# EAGLE board csa_drvio_v1.0b (EAGLE 4.15)
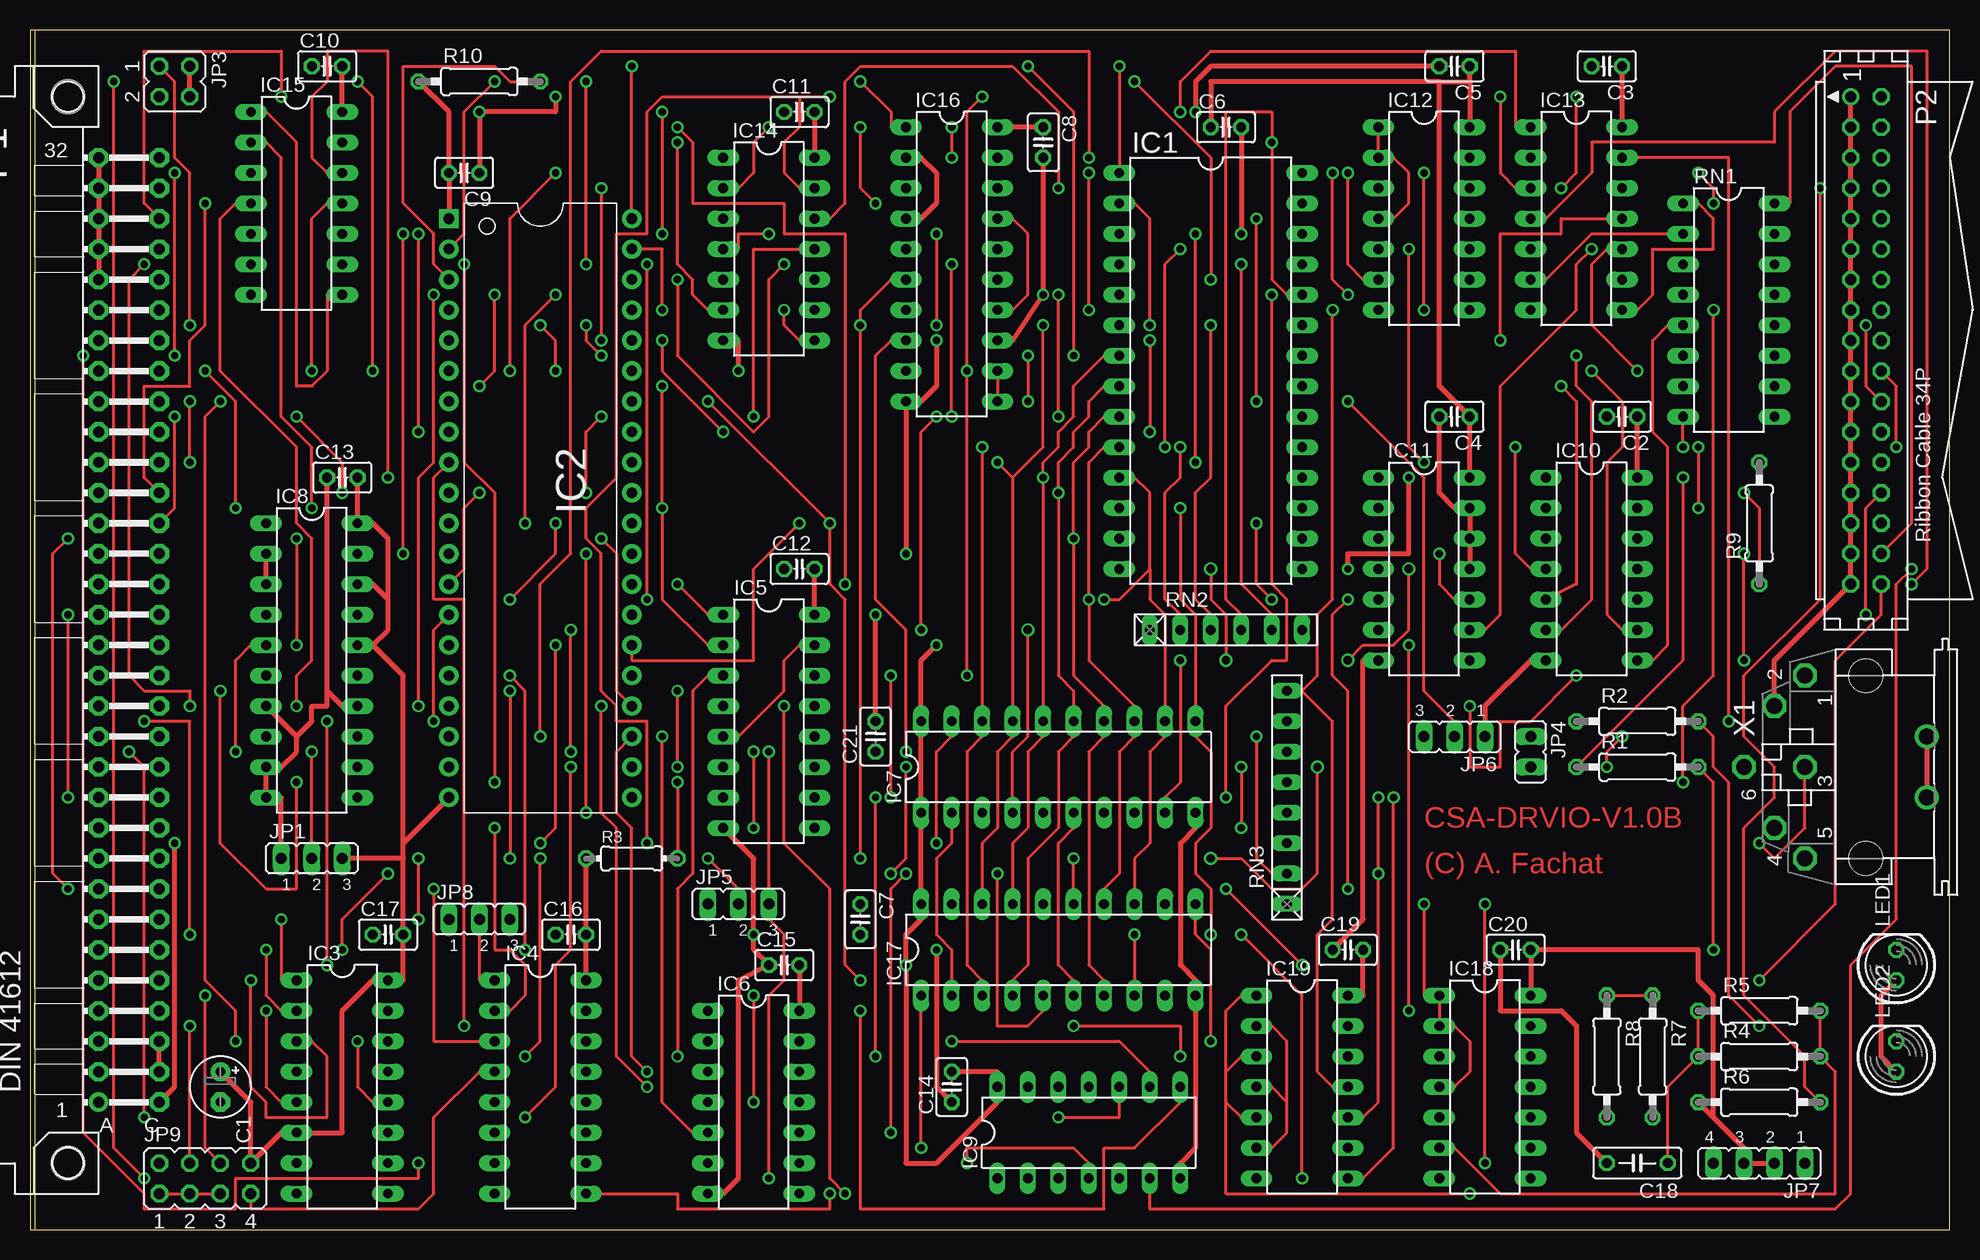
[diagram p1: board, top side]
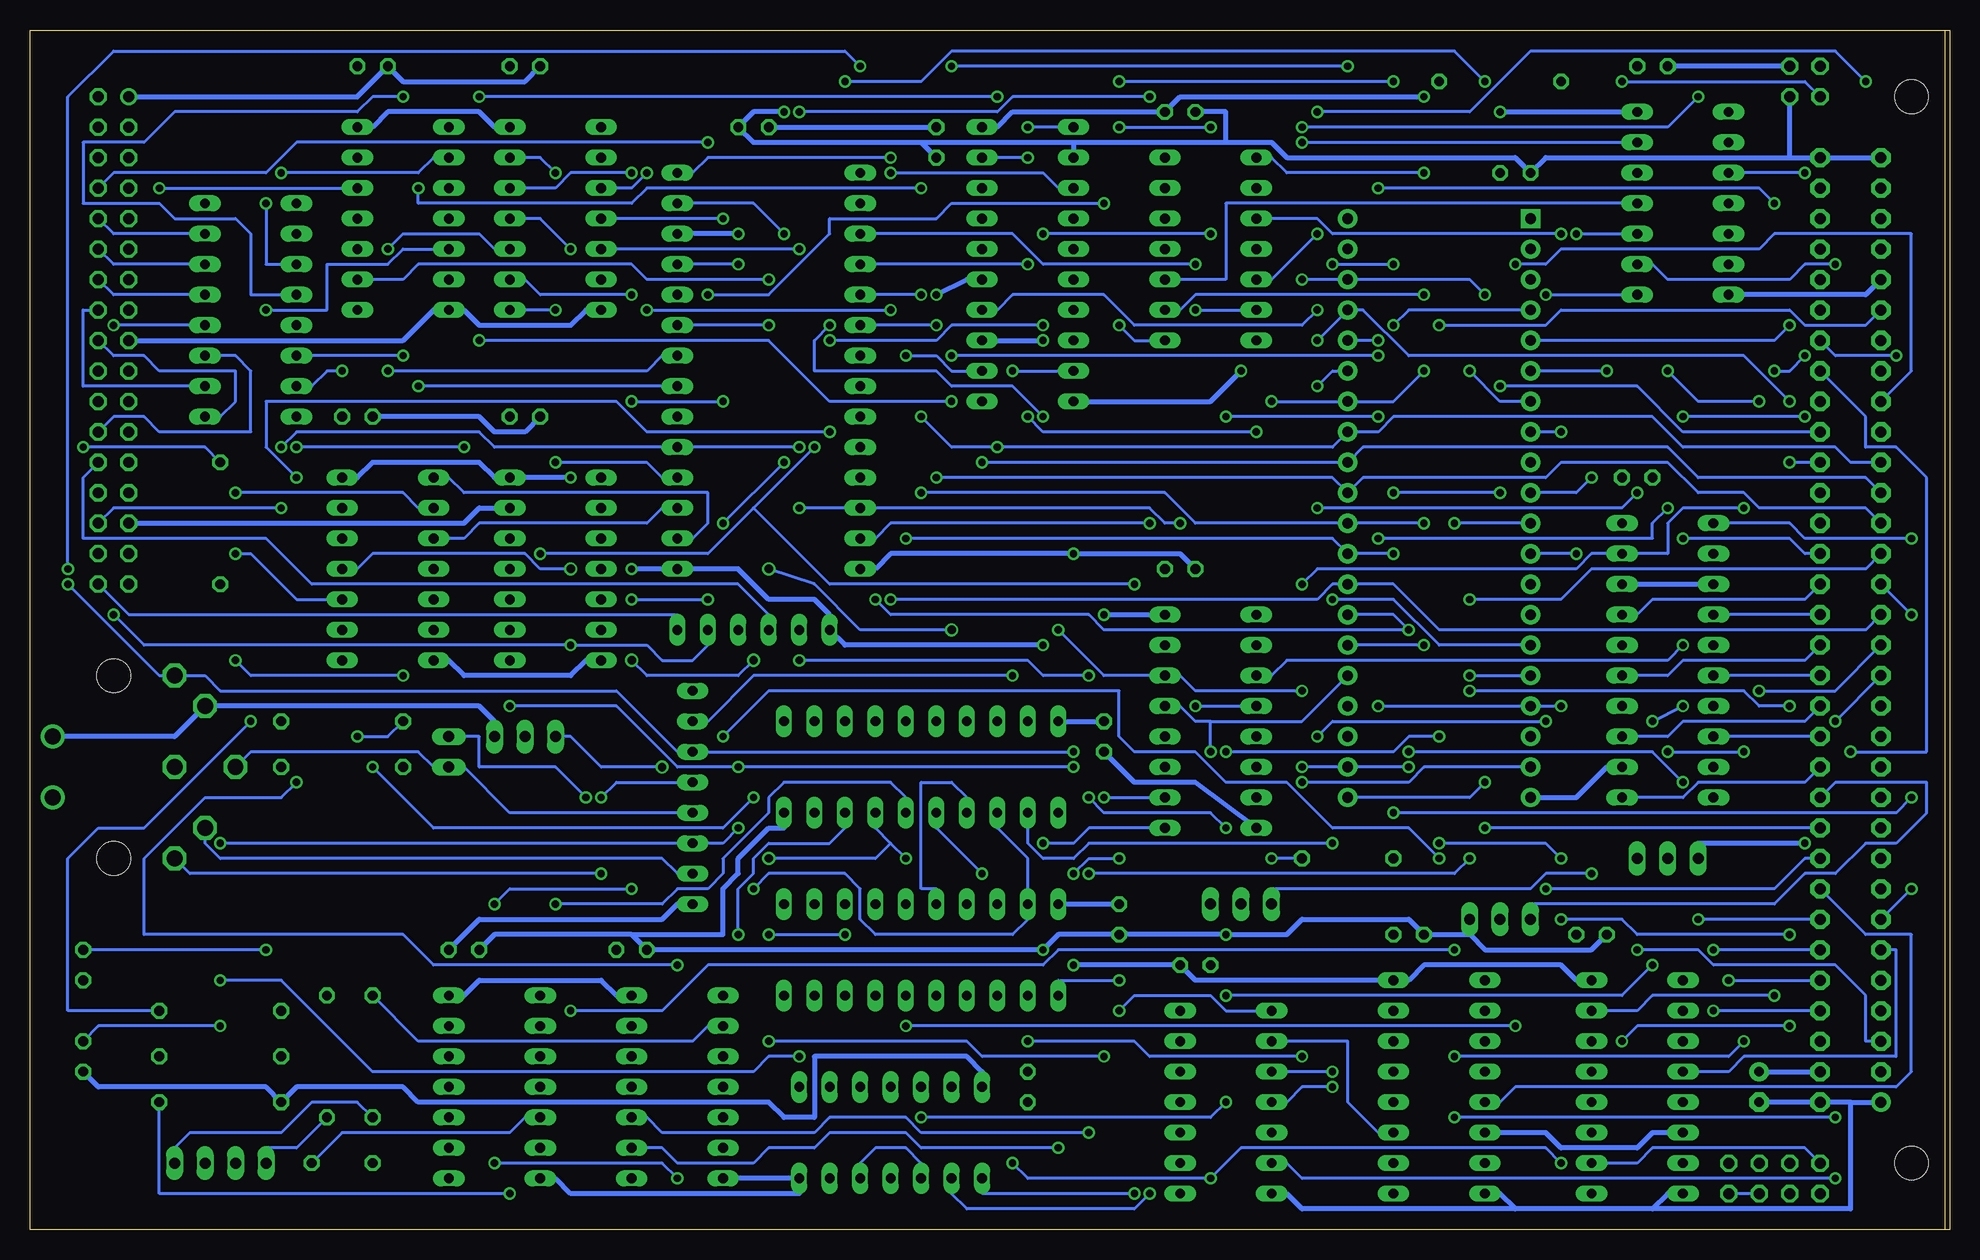
[diagram p2: board, bottom side, seen from below]

Size 160 x 100.03 mm. Coordinates in mm from the lower left corner, seen from the top.
Outline: 0,0.01 160,0.01 160,100.01 0,100.01 0,0.01
Copper layers (1*16): Top 0.035mm / dielectric 1.5mm / Bottom 0.035mm
Design rules "default": minimum track width 10mil, minimum drill 24mil, track to track 8mil, track to pad 8mil, pad to pad 8mil, via to via 8mil, smd to smd 8mil, copper to edge 40mil, drill to drill 8mil, minimum pad ring 10mil, minimum via ring 8mil, stop-mask expansion 4mil, vias tented up to drill 0mil, thermal gap 10mil

## Footprints (pad centres in the part's own frame; a part is rotated, then mirrored left to right if it is on the bottom)
E2,5-5 = drill 0.813 pad 1.6 round: + -1.27,0 | drill 0.813 pad 1.6 octagon: - 1.27,0
C025-025X050 = drill 0.813 octagon: 1 -1.27,0; 2 1.27,0
C050-025X075 = drill 0.813 octagon: 1 -2.54,0; 2 2.54,0
DIL28 = drill 0.813 long: 1 -13.97,-7.62; 2 -11.43,-7.62; 3 -8.89,-7.62; 4 -6.35,-7.62; 5 -3.81,-7.62; 6 -1.27,-7.62; 7 1.27,-7.62; 8 3.81,-7.62; 9 6.35,-7.62; 10 8.89,-7.62; 11 11.43,-7.62; 12 13.97,-7.62; 13 16.51,-7.62; 14 19.05,-7.62; 15 19.05,7.62; 16 16.51,7.62; 17 13.97,7.62; 18 11.43,7.62; 19 8.89,7.62; 20 6.35,7.62; 21 3.81,7.62; 22 1.27,7.62; 23 -1.27,7.62; 24 -3.81,7.62; 25 -6.35,7.62; 26 -8.89,7.62; 27 -11.43,7.62; 28 -13.97,7.62
DIP40 = drill 0.889 pad 1.6 square: 1 -24.13,-7.62 | drill 0.889 pad 1.6 round: 2 -21.59,-7.62; 3 -19.05,-7.62; 4 -16.51,-7.62; 5 -13.97,-7.62; 6 -11.43,-7.62; 7 -8.89,-7.62; 8 -6.35,-7.62; 9 -3.81,-7.62; 10 -1.27,-7.62; 11 1.27,-7.62; 12 3.81,-7.62; 13 6.35,-7.62; 14 8.89,-7.62; 15 11.43,-7.62; 16 13.97,-7.62; 17 16.51,-7.62; 18 19.05,-7.62; 19 21.59,-7.62; 20 24.13,-7.62; 21 24.13,7.62; 22 21.59,7.62; 23 19.05,7.62; 24 16.51,7.62; 25 13.97,7.62; 26 11.43,7.62; 27 8.89,7.62; 28 6.35,7.62; 29 3.81,7.62; 30 1.27,7.62; 31 -1.27,7.62; 32 -3.81,7.62; 33 -6.35,7.62; 34 -8.89,7.62; 35 -11.43,7.62; 36 -13.97,7.62; 37 -16.51,7.62; 38 -19.05,7.62; 39 -21.59,7.62; 40 -24.13,7.62
DIL16 = drill 0.813 long: 1 -8.89,-3.81; 2 -6.35,-3.81; 3 -3.81,-3.81; 4 -1.27,-3.81; 5 1.27,-3.81; 6 3.81,-3.81; 7 6.35,-3.81; 8 8.89,-3.81; 9 8.89,3.81; 10 6.35,3.81; 11 3.81,3.81; 12 1.27,3.81; 13 -1.27,3.81; 14 -3.81,3.81; 15 -6.35,3.81; 16 -8.89,3.81
DIL14 = drill 0.813 long: 1 -7.62,-3.81; 2 -5.08,-3.81; 3 -2.54,-3.81; 4 0,-3.81; 5 2.54,-3.81; 6 5.08,-3.81; 7 7.62,-3.81; 8 7.62,3.81; 9 5.08,3.81; 10 2.54,3.81; 11 0,3.81; 12 -2.54,3.81; 13 -5.08,3.81; 14 -7.62,3.81
DIL20 = drill 0.813 long: 1 -11.43,-3.81; 2 -8.89,-3.81; 3 -6.35,-3.81; 4 -3.81,-3.81; 5 -1.27,-3.81; 6 1.27,-3.81; 7 3.81,-3.81; 8 6.35,-3.81; 9 8.89,-3.81; 10 11.43,-3.81; 11 11.43,3.81; 12 8.89,3.81; 13 6.35,3.81; 14 3.81,3.81; 15 1.27,3.81; 16 -1.27,3.81; 17 -3.81,3.81; 18 -6.35,3.81; 19 -8.89,3.81; 20 -11.43,3.81
DIL20' = drill 0.813 long: 1 -10.16,-3.81; 2 -7.62,-3.81; 3 -5.08,-3.81; 4 -2.54,-3.81; 5 0,-3.81; 6 2.54,-3.81; 7 5.08,-3.81; 8 7.62,-3.81; 9 10.16,-3.81; 10 12.7,-3.81; 11 12.7,3.81; 12 10.16,3.81; 13 7.62,3.81; 14 5.08,3.81; 15 2.54,3.81; 16 0,3.81; 17 -2.54,3.81; 18 -5.08,3.81; 19 -7.62,3.81; 20 -10.16,3.81
JP2 = drill 0.914 long: 1 -2.54,0; 2 0,0; 3 2.54,0
JP2Q = drill 0.914 octagon: 1 -1.27,-1.27; 2 -1.27,1.27; 3 1.27,-1.27; 4 1.27,1.27
JP1 = drill 0.914 long: 1 0,-1.27; 2 0,1.27
JP4 = drill 0.914 long: 1 -3.81,0; 2 -1.27,0; 3 1.27,0; 4 3.81,0
JP4Q = drill 0.914 octagon: 1 -3.81,-1.27; 2 -3.81,1.27; 3 -1.27,-1.27; 4 -1.27,1.27; 5 1.27,-1.27; 6 1.27,1.27; 7 3.81,-1.27; 8 3.81,1.27
LED5MM = drill 0.813 octagon: A -1.27,0; K 1.27,0
CSABUS = drill 0.914 pad 1.6 round: A1 7.62,36.83 | drill 0.914 pad 1.6 octagon: A2 7.62,34.29; A3 7.62,31.75; A4 7.62,29.21; A5 7.62,26.67; A6 7.62,24.13; A7 7.62,21.59; A8 7.62,19.05; A9 7.62,16.51; A10 7.62,13.97; A11 7.62,11.43; A12 7.62,8.89; A13 7.62,6.35; A14 7.62,3.81; A15 7.62,1.27; A16 7.62,-1.27; A17 7.62,-3.81; A18 7.62,-6.35; A19 7.62,-8.89; A20 7.62,-11.43; A21 7.62,-13.97; A22 7.62,-16.51; A23 7.62,-19.05; A24 7.62,-21.59; A25 7.62,-24.13; A26 7.62,-26.67; A27 7.62,-29.21; A28 7.62,-31.75; A29 7.62,-34.29; A30 7.62,-36.83; A31 7.62,-39.37; A32 7.62,-41.91; C1 2.54,36.83; C2 2.54,34.29; C3 2.54,31.75; C4 2.54,29.21; C5 2.54,26.67; C6 2.54,24.13; C7 2.54,21.59; C8 2.54,19.05; C9 2.54,16.51; C10 2.54,13.97; C11 2.54,11.43; C12 2.54,8.89; C13 2.54,6.35; C14 2.54,3.81; C15 2.54,1.27; C16 2.54,-1.27; C17 2.54,-3.81; C18 2.54,-6.35; C19 2.54,-8.89; C20 2.54,-11.43; C21 2.54,-13.97; C22 2.54,-16.51; C23 2.54,-19.05; C24 2.54,-21.59; C25 2.54,-24.13; C26 2.54,-26.67; C27 2.54,-29.21; C28 2.54,-31.75; C29 2.54,-34.29; C30 2.54,-36.83; C31 2.54,-39.37; C32 2.54,-41.91 | hole 2.794: 10.16,41.91; 10.16,-46.99
CON34 = drill 0.914 round: 1 -19.05,-1.27 | drill 0.914 octagon: 2 -19.05,1.27; 3 -16.51,-1.27; 4 -16.51,1.27; 5 -13.97,-1.27; 6 -13.97,1.27; 7 -11.43,-1.27; 8 -11.43,1.27; 9 -8.89,-1.27; 10 -8.89,1.27; 11 -6.35,-1.27; 12 -6.35,1.27; 13 -3.81,-1.27; 14 -3.81,1.27; 15 -1.27,-1.27; 16 -1.27,1.27; 17 1.27,-1.27; 18 1.27,1.27; 19 3.81,-1.27; 20 3.81,1.27; 21 6.35,-1.27; 22 6.35,1.27; 23 8.89,-1.27; 24 8.89,1.27; 25 11.43,-1.27; 26 11.43,1.27; 27 13.97,-1.27; 28 13.97,1.27; 29 16.51,-1.27; 30 16.51,1.27; 31 19.05,-1.27; 32 19.05,1.27; 33 21.59,-1.27; 34 21.59,1.27
0207/10 = drill 0.813 octagon: 1 -5.08,0; 2 5.08,0
0204/7 = drill 0.813 octagon: 1 -3.81,0; 2 3.81,0
RN-6 = drill 0.813 long: 1 -6.35,0; 2 -3.81,0; 3 -1.27,0; 4 1.27,0; 5 3.81,0; 6 6.35,0
RN-8 = drill 0.813 long: 1 -8.89,0; 2 -6.35,0; 3 -3.81,0; 4 -1.27,0; 5 1.27,0; 6 3.81,0; 7 6.35,0; 8 8.89,0
MAB6H = drill 1.321 octagon: 1 7.62,5.08; 2 5.08,7.62; 3 0,5.08; 4 -5.08,7.62; 5 -7.62,5.08; 6 0,10.16 | drill 1.321 round: PE -2.54,-5.08; PE@ 2.54,-5.08 | hole 2.794: 7.62,0; -7.62,0

## Placement (x,y rotation side)
C1  47u  [E2,5-5]  15.87,11.91 270 top
C2  [C025-025X050]  132.71,67.79 180 top
C3  [C025-025X050]  131.44,97 180 top
C4  [C025-025X050]  118.74,67.79 180 top
C5  [C025-025X050]  118.74,97 180 top
C6  [C025-025X050]  99.69,91.92 0 top
C7  [C025-025X050]  69.21,25.88 270 top
C8  [C025-025X050]  84.45,90.65 270 top
C9  [C025-025X050]  36.19,88.11 180 top
C10  [C025-025X050]  24.76,97 0 top
C11  [C025-025X050]  64.13,93.19 0 top
C12  [C025-025X050]  64.13,55.09 0 top
C13  [C025-025X050]  26.03,62.71 0 top
C14  [C025-025X050]  76.83,11.91 90 top
C15  [C025-025X050]  62.86,22.07 0 top
C16  [C025-025X050]  45.08,24.61 0 top
C17  [C025-025X050]  29.84,24.61 0 top
C18  100n  [C050-025X075]  133.98,5.56 180 top
C19  [C025-025X050]  109.85,23.34 0 top
C20  [C025-025X050]  123.82,23.34 0 top
C21  [C025-025X050]  70.48,41.12 90 top
IC1  WD1770  [DIL28]  98.42,74.14 270 top
IC2  CIASMALLPADS  [DIP40]  42.54,60.17 270 top
IC3  74HCT138N  [DIL16]  26.03,11.91 270 top
IC4  74HCT138N  [DIL16]  42.54,11.91 270 top
IC5  74HCT139N  [DIL16]  61.59,42.39 270 top
IC6  74HCT08N  [DIL14]  60.32,10.64 270 top
IC7  74HCT245N  [DIL20]  85.72,38.58 0 top
IC8  74LS688BUSOPT  [DIL20']  23.49,48.74 270 top
IC9  74HCT00N  [DIL14]  88.26,8.1 0 top
IC10  74LS06N  [DIL14]  130.17,55.09 270 top
IC11  74LS293N  [DIL14]  116.2,55.09 270 top
IC12  74HCT00N  [DIL14]  116.2,84.3 270 top
IC13  74LS07N  [DIL14]  128.9,84.3 270 top
IC14  74LS06N  [DIL14]  61.59,81.76 270 top
IC15  74HC14N  [DIL14]  22.22,85.57 270 top
IC16  74HCT241N  [DIL20]  76.83,80.49 270 top
IC17  74LS273BUSOPT  [DIL20']  84.45,23.34 0 top
IC18  74LS13N  [DIL14]  121.28,11.91 270 top
IC19  74LS07N  [DIL14]  106.04,11.91 270 top
JP1  [JP2]  23.49,30.96 0 top
JP3  [JP2Q]  12.06,95.73 270 top
JP4  [JP1]  125.09,39.85 180 top
JP5  [JP2]  59.05,27.15 0 top
JP6  [JP2]  118.74,41.12 180 top
JP7  [JP4]  144.14,5.56 180 top
JP8  [JP2]  37.46,25.88 0 top
JP9  [JP4Q]  14.6,4.29 0 top
LED1  [LED5MM]  155.57,22.07 90 top
LED2  [LED5MM]  155.57,14.45 90 top
P1  CSABUS  [CSABUS]  13.33,47.47 180 top
P2  SHUGART  [CON34]  153.03,75.41 270 top
R1  150  [0207/10]  133.98,38.58 0 top
R2  620  [0207/10]  133.98,42.39 0 top
R3  10k  [0204/7]  50.16,30.96 0 top
R4  220  [0207/10]  144.14,14.45 0 top
R5  1k2  [0207/10]  144.14,18.26 0 top
R6  10k  [0207/10]  144.14,10.64 0 top
R7  68  [0207/10]  135.25,14.45 270 top
R8  68  [0207/10]  131.44,14.45 270 top
R9  47  [0207/10]  144.14,58.9 90 top
R10  2k2  [0207/10]  37.46,95.73 0 top
RN1  47  [DIL16]  141.6,76.68 270 top
RN2  10k  [RN-6]  99.69,50.01 0 top
RN3  10k  [RN-8]  104.77,36.04 90 top
X1  MAB6H  [MAB6H]  153.03,38.58 90 top

## Tracks (layer width: path | path; a pad name or v marks a point on that pad's centre or on a via)
16MHZ  (via drill 0.61)
  Top 0.254: v95.88,81.76 94.61,80.49 v94.61,65.25 | v117.47,56.36 117.47,53.82 118.74,52.55 IC11.10 | P1.C30 9.52,85.57 9.52,98.27 20.95,98.27 v20.95,94.46 | v53.97,91.92 55.24,90.65 55.24,85.57 62.86,85.57 62.86,83.03 67.94,83.03 v67.94,53.82
  Bottom 0.254: 99.69,60.17 103.5,56.36 v117.47,56.36 | 99.69,60.17 v94.61,65.25 | v95.88,81.76 IC12.5 | v20.95,94.46 23.49,91.92 v53.97,91.92 | v67.94,53.82 93.34,53.82 99.69,60.17
50HZ  (via drill 0.61)
  Top 0.254: v29.84,29.69 26.03,25.88 v26.03,23.34
  Bottom 0.254: v29.84,29.69 33.65,29.69 34.92,28.42 56.51,28.42 JP5.1 | v26.03,23.34 20.95,23.34 19.68,22.07 9.52,22.07 6.98,19.53 6.98,15.72 P1.A3
/CIA
  Bottom 0.254: IC4.11 47.62,8.1 50.16,10.64 50.16,15.72 IC6.2
/CIASEL  (via drill 0.61)
  Top 0.254: v51.43,13.18 50.16,14.45 50.16,33.5 48.89,34.77 48.89,39.85 IC2.23
  Bottom 0.254: v51.43,13.18 IC6.3
/IOSEL  (via drill 0.61)
  Top 0.254: v3.17,57.63 1.9,56.36 1.9,29.69 v3.17,28.42
  Bottom 0.254: v3.17,57.63 12.06,57.63 13.33,58.9 IC8.1 | v3.17,28.42 P1.A7
/IRQ  (via drill 0.61)
  Top 0.254: v36.19,80.49 36.19,63.98 38.73,61.44 v38.73,37.31
  Bottom 0.254: P1.A24 3.17,71.6 3.17,83.03 14.6,83.03 15.87,81.76 32.38,81.76 33.65,80.49 v36.19,80.49 | v38.73,37.31 40,36.04 IC2.21
/MEMSEL
  Bottom 0.254: P1.A6 4.44,23.34 4.44,14.45 17.14,14.45 18.41,13.18 IC3.4
/RCTRL  (via drill 0.61)
  Top 0.254: v75.56,32.23 75.56,39.85 76.83,41.12 IC7.19
  Bottom 0.254: v75.56,32.23 73.02,32.23 71.75,33.5 IC5.9
/RES  (via drill 0.61)
  Top 0.254: v74.29,6.83 IC17.1 | v56.51,69.06 v66.67,58.9 66.67,53.82 67.94,52.55 67.94,22.07 v69.21,20.8 | v42.54,75.41 43.81,74.14 v43.81,71.6
  Bottom 0.254: v74.29,6.83 85.72,6.83 86.99,8.1 93.34,8.1 94.61,6.83 98.42,6.83 99.69,5.56 106.04,5.56 107.31,6.83 IC19.9 | v66.67,58.9 88.26,58.9 89.53,57.63 IC1.13 | v56.51,69.06 IC2.34 46.35,69.06 v43.81,71.6 | P1.A27 6.98,75.41 12.06,75.41 13.33,76.68 32.38,76.68 33.65,75.41 v42.54,75.41 | v69.21,20.8 74.29,20.8 IC17.1
/SELB  (via drill 0.61)
  Top 0.254: IC17.2 76.83,23.34 75.56,24.61 75.56,30.96 76.83,32.23 IC7.2 | 64.13,94.46 64.13,91.92 62.86,90.65 62.86,88.11 64.13,86.84 IC14.13 | 64.13,94.46 v66.67,94.46 | v95.88,93.19 95.88,95.73 98.42,98.27 123.82,98.27 123.82,91.92 IC13.1 | v51.43,32.23 51.43,42.39 48.89,42.39 48.89,43.66 47.62,44.93 47.62,56.36 46.35,57.63 46.35,60.17 48.89,62.71 48.89,83.03 51.43,83.03 51.43,93.19 52.7,94.46 64.13,94.46
  Bottom 0.254: v66.67,94.46 78.1,94.46 79.37,93.19 v95.88,93.19 | v51.43,32.23 71.75,32.23 73.02,30.96 75.56,30.96 76.83,32.23 IC7.2
/WCTRL  (via drill 0.61)
  Top 0.254: v70.48,14.45 v70.48,36.04 | v98.42,15.72 98.42,23.34 97.15,24.61 IC17.11
  Bottom 0.254: v70.48,14.45 80.64,14.45 81.91,15.72 v98.42,15.72 | v70.48,36.04 IC5.10
/WDC  (via drill 0.61)
  Top 0.254: v66.67,3.02 66.67,1.75 53.97,1.75 53.97,3.02 IC4.9
  Bottom 0.254: v66.67,3.02 67.94,1.75 81.91,1.75 83.18,3.02 IC9.2
A0  (via drill 0.61)
  Top 0.254: v62.86,80.49 61.59,79.22 61.59,67.79 60.32,66.52 53.97,72.87 v53.97,79.22 | v37.46,70.33 38.73,71.6 v38.73,77.95
  Bottom 0.254: v62.86,80.49 75.56,80.49 78.1,83.03 IC1.3 | v53.97,79.22 IC2.38 40,79.22 v38.73,77.95 | P1.C23 22.22,66.52 26.03,70.33 v37.46,70.33
A1  (via drill 0.61)
  Top 0.254: v76.83,67.79 v76.83,80.49 | v57.78,66.52 52.7,71.6 v52.7,74.14 | v13.33,63.98 v13.33,69.06
  Bottom 0.254: v76.83,67.79 75.56,66.52 v57.78,66.52 | v52.7,74.14 IC2.37 48.89,76.68 45.08,72.87 17.14,72.87 v13.33,69.06 | v76.83,80.49 IC1.4 | P1.C22 v13.33,63.98
A2  (via drill 0.61)
  Top 0.254: P1.C21 9.52,62.71 9.52,70.33 13.33,70.33 13.33,74.14 14.6,75.41 v14.6,85.57 | v47.62,86.84 v47.62,74.14
  Bottom 0.254: v14.6,85.57 15.87,86.84 v47.62,86.84 | v47.62,74.14 IC2.36
A3  (via drill 0.61)
  Top 0.254: v52.7,70.33 v52.7,60.17 52.7,52.55 56.51,48.74 IC5.2 | P1.C20 12.06,60.17 v12.06,67.79 | v22.22,67.79 26.03,63.98 v26.03,61.44
  Bottom 0.254: v52.7,70.33 51.43,71.6 IC2.35 | v12.06,67.79 v22.22,67.79 | v26.03,61.44 27.3,60.17 v52.7,60.17
A4  (via drill 0.61)
  Top 0.254: v22.22,57.63 v22.22,48.74 | v76.83,15.72 90.8,15.72 93.34,13.18 IC9.9 | v53.97,14.45 53.97,28.42 55.24,29.69 55.24,44.93 56.51,46.2 IC5.3
  Bottom 0.254: v22.22,48.74 23.49,47.47 55.24,47.47 56.51,46.2 IC5.3 | v22.22,57.63 13.33,57.63 12.06,56.36 P1.C19 | v76.83,15.72 67.94,15.72 66.67,14.45 v53.97,14.45
A5
  Bottom 0.254: P1.C18 12.06,52.55 24.76,52.55 26.03,51.28 IC8.17
A6
  Bottom 0.254: P1.C17 IC8.4
A7
  Bottom 0.254: P1.C16 12.06,47.47 22.22,47.47 23.49,46.2 IC8.15
A8
  Bottom 0.254: P1.C15 IC8.6
A9
  Bottom 0.254: P1.C14 12.06,42.39 22.22,42.39 23.49,41.12 IC8.13
A10
  Bottom 0.254: P1.C13 IC8.8
A11
  Bottom 0.254: P1.C12 12.06,37.31 20.95,37.31 22.22,36.04 IC8.11
A12
  Bottom 0.254: P1.C11 9.52,37.31 1.9,37.31 1.9,34.77 4.44,32.23 6.98,32.23 9.52,29.69 12.06,29.69 14.6,27.15 34.92,27.15 JP8.1
A13  (via drill 0.61)
  Top 0.254: v38.73,33.5 38.73,23.34 40,23.34 41.27,22.07 41.27,19.53 40,18.26 IC4.2
  Bottom 0.254: P1.C10 v38.73,33.5
A14  (via drill 0.61)
  Top 0.254: v33.65,28.42 33.65,15.72 IC4.3
  Bottom 0.254: v33.65,28.42 14.6,28.42 12.06,30.96 P1.C9
A15
  Bottom 0.254: P1.C8 6.98,24.61 3.17,24.61 3.17,13.18 4.44,11.91 36.19,11.91 37.46,10.64 IC4.5
A16  (via drill 0.61)
  Top 0.254: v20.95,25.88 20.95,20.8 IC3.1
  Bottom 0.254: P1.C7 v20.95,25.88
A17  (via drill 0.61)
  Top 0.254: v19.68,23.34 19.68,19.53 20.95,18.26 IC3.2
  Bottom 0.254: P1.C6 v19.68,23.34
A18  (via drill 0.61)
  Top 0.254: v18.41,20.8 18.41,11.91 19.68,10.64 19.68,9.37 24.76,9.37 24.76,14.45 23.49,15.72 IC3.3
  Bottom 0.254: v18.41,20.8 P1.C5
A19  (via drill 0.61)
  Top 0.254: v19.68,18.26 19.68,11.91 20.95,10.64 IC3.5
  Bottom 0.254: P1.C4 v19.68,18.26
ACTLED  (via drill 0.61)
  Top 0.254: v32.38,66.52 v32.38,83.03
  Bottom 0.254: v32.38,83.03 51.43,83.03 52.7,84.3 IC14.3 | v32.38,66.52 IC2.8
ATN  (via drill 0.61)
  Top 0.254: v144.14,32.23 145.41,30.96 147.95,33.5 X1.3 | v9.52,80.49 8.25,79.22 8.25,46.2 9.52,44.93 13.33,44.93 v13.33,43.66 | v40,44.93 v40,30.96 | v71.75,29.69 73.02,30.96 v73.02,38.58 | v100.96,38.58 v100.96,33.5 | v142.87,47.47 v142.87,56.36 | v128.9,46.2 125.09,42.39 122.55,42.39 122.55,38.58 120.01,38.58 v120.01,43.66
  Bottom 0.254: v144.14,32.23 RN3.3 102.23,32.23 v100.96,33.5 | v9.52,80.49 12.06,80.49 13.33,79.22 23.49,79.22 24.76,80.49 IC15.9 | v13.33,43.66 15.87,43.66 17.14,44.93 v40,44.93 | v40,30.96 41.27,29.69 v71.75,29.69 | v73.02,38.58 v100.96,38.58 106.04,38.58 111.12,43.66 v120.01,43.66 | v142.87,56.36 141.6,56.36 137.79,52.55 IC10.10 | v142.87,47.47 141.6,46.2 v128.9,46.2
ATNA  (via drill 0.61)
  Top 0.254: v52.7,41.12 52.7,10.64 55.24,8.1 IC6.5 | v33.65,42.39 33.65,50.01 IC2.14
  Bottom 0.254: v52.7,41.12 51.43,42.39 v33.65,42.39
ATNIN  (via drill 0.61)
  Top 0.254: IC15.8 24.76,77.95 24.76,71.6 23.49,70.33 22.22,70.33 22.22,90.65 19.68,93.19 IC15.1 | v51.43,11.91 48.89,14.45 48.89,33.5 47.62,34.77 v47.62,43.66 | v33.65,77.95 33.65,63.98 32.38,62.71 v32.38,43.66
  Bottom 0.254: v51.43,11.91 53.97,11.91 55.24,10.64 IC6.4 | v47.62,43.66 IC2.17 v32.38,43.66 | v33.65,77.95 IC15.8
CLKIN  (via drill 0.61)
  Top 0.254: v31.11,56.36 v31.11,83.03
  Bottom 0.254: v31.11,56.36 IC2.12 | v31.11,83.03 IC15.10
CLKOUT  (via drill 0.61)
  Top 0.254: v60.32,67.79 60.32,81.76 IC14.11 | v47.62,67.79 46.35,66.52 v46.35,61.44 | v37.46,61.44 36.19,60.17 36.19,55.09 IC2.13
  Bottom 0.254: v47.62,67.79 v60.32,67.79 | v37.46,61.44 v46.35,61.44
D0  (via drill 0.61)
  Top 0.254: IC17.3 79.37,20.8 78.1,22.07 78.1,39.85 79.37,41.12 IC7.18 v79.37,65.25 | v85.72,67.79 v85.72,77.95
  Bottom 0.254: v85.72,67.79 83.18,65.25 v79.37,65.25 51.43,65.25 IC2.33 47.62,66.52 46.35,67.79 24.76,67.79 22.22,65.25 9.52,65.25 8.25,63.98 P1.A22 | v85.72,77.95 IC1.5
D1  (via drill 0.61)
  Top 0.254: IC17.18 79.37,32.23 80.64,33.5 80.64,39.85 81.91,41.12 IC7.17 81.91,62.71 | v84.45,75.41 84.45,65.25 81.91,62.71 | v80.64,63.98 81.91,62.71
  Bottom 0.254: P1.A21 6.98,62.71 20.95,62.71 23.49,65.25 48.89,65.25 IC2.32 v80.64,63.98 | v84.45,75.41 IC1.6
D2  (via drill 0.61)
  Top 0.254: IC17.17 81.91,32.23 83.18,33.5 83.18,39.85 84.45,41.12 IC7.16 v84.45,62.71 84.45,63.98 85.72,65.25 85.72,66.52 86.99,67.79 86.99,70.33 89.53,72.87 IC1.7
  Bottom 0.254: P1.A20 6.98,60.17 15.87,60.17 17.14,61.44 20.95,61.44 23.49,63.98 32.38,63.98 33.65,62.71 48.89,62.71 IC2.31 51.43,62.71 v84.45,62.71
D3  (via drill 0.61)
  Top 0.254: v40,52.55 43.81,56.36 v43.81,58.9 | IC17.4 81.91,20.8 83.18,22.07 83.18,30.96 85.72,33.5 85.72,39.85 86.99,41.12 IC7.15 86.99,44.93 85.72,46.2 v85.72,61.44 85.72,63.98 86.99,65.25 86.99,66.52 88.26,67.79 88.26,69.06 89.53,70.33 IC1.8
  Bottom 0.254: P1.A19 6.98,55.09 29.84,55.09 32.38,52.55 v40,52.55 | v43.81,58.9 IC2.30 62.86,58.9 65.4,61.44 v85.72,61.44
D4  (via drill 0.61)
  Top 0.254: IC17.7 89.53,20.8 88.26,22.07 88.26,39.85 89.53,41.12 IC7.14 89.53,43.66 86.99,46.2 v86.99,57.63 86.99,63.98 88.26,65.25 88.26,66.52 89.53,67.79 IC1.9 | v3.17,36.04 v3.17,51.28 | v46.35,34.77 v46.35,56.36
  Bottom 0.254: v3.17,51.28 P1.A18 | v3.17,36.04 4.44,34.77 v46.35,34.77 | v46.35,56.36 IC2.29 51.43,57.63 v86.99,57.63
D5  (via drill 0.61)
  Top 0.254: IC17.14 89.53,28.42 90.8,29.69 90.8,39.85 92.07,41.12 IC7.13 92.07,43.66 88.26,47.47 v88.26,52.55 88.26,63.98 89.53,65.25 IC1.10
  Bottom 0.254: P1.A17 6.98,50.01 42.54,50.01 46.35,53.82 IC2.28 51.43,53.82 52.7,52.55 v88.26,52.55
D6  (via drill 0.61)
  Top 0.254: IC17.13 92.07,30.96 93.34,32.23 93.34,39.85 94.61,41.12 IC7.12 94.61,51.28 93.34,52.55 93.34,55.09 | 93.34,55.09 93.34,61.44 92.07,62.71 IC1.11 | v15.87,44.93 15.87,32.23 19.68,28.42 22.22,28.42 v22.22,37.31 | v45.08,39.85 v45.08,50.01 | v89.53,52.55 90.8,52.55 93.34,55.09
  Bottom 0.254: P1.A16 9.52,44.93 v15.87,44.93 | v22.22,37.31 24.76,39.85 v45.08,39.85 | IC2.27 46.35,51.28 v45.08,50.01 70.48,50.01 71.75,51.28 88.26,51.28 v89.53,52.55
D7  (via drill 0.61)
  Top 0.254: v98.42,24.61 98.42,28.42 97.15,29.69 97.15,32.23 98.42,33.5 98.42,39.85 97.15,41.12 IC7.11 97.15,51.28 95.88,52.55 v95.88,60.17 | v92.07,24.61 IC17.8 | v9.52,42.39 13.33,42.39 v13.33,24.61 | v32.38,25.88 v32.38,30.96 | v42.54,32.23 43.81,33.5 v43.81,48.74 | v64.13,58.9 60.32,55.09 60.32,47.47 50.16,47.47 IC2.26
  Bottom 0.254: v98.42,24.61 v92.07,24.61 | v95.88,60.17 IC1.12 66.67,60.17 65.4,58.9 v64.13,58.9 | v9.52,42.39 P1.A15 | v13.33,24.61 26.03,24.61 27.3,25.88 v32.38,25.88 | v32.38,30.96 33.65,32.23 v42.54,32.23 | v43.81,48.74 IC2.26
DATA  (via drill 0.61)
  Top 0.254: v62.86,76.68 62.86,75.41 64.13,74.14 IC14.8 | v53.97,90.65 53.97,80.49 55.24,79.22 55.24,77.95 56.51,76.68 IC14.6 | IC16.6 71.75,79.22 69.21,76.68 v69.21,75.41 v69.21,30.96 | v112.39,36.04 v112.39,29.69 112.39,10.64 111.12,9.37 IC19.10 | v73.02,29.69 71.75,28.42 v71.75,8.1
  Bottom 0.254: v62.86,76.68 IC14.6 | v53.97,90.65 IC15.13 | v69.21,75.41 67.94,74.14 IC14.8 | v112.39,36.04 111.12,37.31 RN3.5 | X1.5 146.68,29.69 v112.39,29.69 | v69.21,30.96 71.75,30.96 v73.02,29.69 | v71.75,8.1 85.72,8.1 86.99,9.37 93.34,9.37 94.61,8.1 107.31,8.1 108.58,9.37 IC19.10
DATAIN  (via drill 0.61)
  Top 0.254: v29.84,62.71 29.84,98.27 24.76,98.27 24.76,95.73 23.49,94.46 23.49,89.38 24.76,88.11 IC15.12
  Bottom 0.254: v29.84,62.71 31.11,61.44 IC2.10
DATAOUT  (via drill 0.61)
  Top 0.254: v43.81,77.95 41.27,75.41 v41.27,58.9
  Bottom 0.254: v43.81,77.95 62.86,77.95 64.13,76.68 IC14.9 | IC2.11 v41.27,58.9
DDSKCHG  (via drill 0.61)
  Top 0.254: IC2.9 33.65,62.71 33.65,52.55 36.19,52.55 v36.19,16.99 | v86.99,16.99 95.88,16.99 v95.88,14.45 | v144.14,20.8 150.49,27.15 150.49,47.47 154.3,51.28 P2.34
  Bottom 0.254: P2.34 151.76,51.28 106.04,51.28 RN2.6 | v36.19,16.99 v86.99,16.99 | v95.88,14.45 98.42,14.45 99.69,13.18 131.44,13.18 139.06,20.8 v144.14,20.8
DINDEX  (via drill 0.61)
  Top 0.254: RN2.4 100.96,51.28 99.69,52.55 99.69,93.19 103.5,93.19 v103.5,90.65 103.5,79.22 104.77,77.95 IC1.24
  Bottom 0.254: P2.8 153.03,88.11 140.33,88.11 137.79,90.65 v103.5,90.65
DIR
  Bottom 0.254: IC1.17 107.31,60.17 108.58,58.9 122.55,58.9 123.82,57.63 IC10.3
DMTRA  (via drill 0.61)
  Top 0.254: v133.98,71.6 130.17,75.41 130.17,80.49 131.44,81.76 IC13.10
  Bottom 0.254: v133.98,71.6 135.25,71.6 136.52,70.33 RN1.7
DMTRB
  Top 0.254: IC13.6 126.36,79.22 130.17,83.03 RN1.2
DRDDATA  (via drill 0.61)
  Top 0.254: RN2.2 95.88,51.28 94.61,52.55 94.61,61.44 95.88,62.71 v95.88,65.25 | v139.06,65.25 v139.06,60.17
  Bottom 0.254: v95.88,65.25 IC1.19 121.28,65.25 122.55,66.52 137.79,66.52 v139.06,65.25 | P2.30 153.03,60.17 v139.06,60.17
DRDY
  Top 0.254: R10.2 40,95.73 38.73,97 31.11,97 31.11,85.57 33.65,83.03 33.65,80.49 IC2.3
DSELB  (via drill 0.61)
  Top 0.254: v139.06,88.11 140.33,86.84 v140.33,85.57
  Bottom 0.254: v139.06,88.11 127.63,88.11 126.36,89.38 IC13.2 | v140.33,85.57 140.33,80.49 RN1.3
DTR00  (via drill 0.61)
  Top 0.254: RN2.3 98.42,51.28 97.15,52.55 97.15,61.44 98.42,62.71 v98.42,75.41
  Bottom 0.254: v98.42,75.41 IC1.23 | P2.26 155.57,62.71 155.57,57.63 140.33,57.63 136.52,53.82 100.96,53.82 98.42,51.28 RN2.3
DWPROT  (via drill 0.61)
  Top 0.254: v100.96,80.49 100.96,53.82 103.5,51.28 RN2.5 | P2.28 153.03,60.17 v153.03,51.28 | v40,46.2 41.27,44.93 v41.27,23.34 | v114.93,18.26 v114.93,48.74
  Bottom 0.254: v100.96,80.49 IC1.25 | v153.03,51.28 150.49,48.74 v114.93,48.74 108.58,48.74 107.31,47.47 104.77,47.47 103.5,48.74 RN2.5 | v40,46.2 IC2.16 | v41.27,23.34 74.29,23.34 75.56,22.07 103.5,22.07 107.31,18.26 v114.93,18.26
FASTCLK  (via drill 0.61)
  Top 0.254: v73.02,39.85 73.02,50.01 70.48,52.55 70.48,72.87 71.75,74.14 IC16.8 | v156.84,53.82 158.11,55.09 158.11,98.27 150.49,98.27 145.41,93.19 145.41,90.65 130.17,90.65 130.17,88.11 126.36,84.3 IC13.4
  Bottom 0.254: v73.02,39.85 RN3.6 106.04,39.85 111.12,44.93 144.14,44.93 145.41,46.2 X1.1 149.22,46.2 v156.84,53.82
FSERCLK  (via drill 0.61)
  Top 0.254: IC16.12 IC16.11 | IC2.40 v50.16,97 | v83.18,97 86.99,93.19 v86.99,72.87
  Bottom 0.254: v50.16,97 v83.18,97 | v86.99,72.87 84.45,72.87 83.18,71.6 IC16.12
FSERDATA  (via drill 0.61)
  Top 0.254: IC16.14 81.91,76.68 83.18,77.95 83.18,83.03 81.91,84.3 IC16.17 | IC2.39 52.7,81.76 v52.7,76.68
  Bottom 0.254: v52.7,76.68 53.97,75.41 67.94,75.41 70.48,77.95 78.1,77.95 79.37,76.68 IC16.14
FSERDIR  (via drill 0.61)
  Top 0.254: v76.83,91.92 v76.83,89.38 | v51.43,52.55 v51.43,80.49 | v46.35,80.49 v46.35,95.73 | v69.21,95.73 71.75,93.19 71.75,91.92 IC16.1
  Bottom 0.254: IC16.1 v76.83,91.92 | v76.83,89.38 IC16.19 | IC2.15 42.54,48.74 46.35,52.55 v51.43,52.55 | v51.43,80.49 v46.35,80.49 | v46.35,95.73 v69.21,95.73
GND  (via drill 0.61)
  Top 0.254: 74.29,69.06 IC16.10 | IC11.13 118.74,60.17 | IC10.7 125.09,47.47
  Top 0.406: P1.A28 P1.A29 P1.A30 P1.A31 P1.A32 | JP3.4 JP3.2 | IC2.1 C9.2 34.92,93.19 R10.1 | IC16.4 74.29,84.3 75.56,85.57 75.56,88.11 74.29,89.38 IC16.2 | 74.29,69.06 75.56,70.33 v75.56,74.14 | v59.05,71.6 59.05,74.14 IC14.7 | IC16.13 81.91,74.14 v84.45,77.95 C8.2 | C6.2 v100.96,83.03 | IC16.10 v73.02,56.36 | 22.22,41.12 22.22,39.85 20.95,38.58 IC8.9 IC8.10 20.95,36.04 JP1.1 | 22.22,41.12 IC8.7 | 24.76,44.93 26.03,43.66 IC8.14 | 24.76,44.93 C13.1 | 22.22,41.12 23.49,42.39 23.49,43.66 24.76,43.66 24.76,44.93 | IC5.8 60.32,30.96 v60.32,24.61 60.32,23.34 C15.1 59.05,20.8 59.05,4.29 57.78,3.02 IC6.7 | v12.06,32.23 12.06,11.91 P1.C1 | IC11.11 IC11.12 IC11.13 | C4.2 117.47,61.44 118.74,60.17 | P2.1 P2.3 P2.5 P2.7 P2.9 P2.11 P2.13 P2.15 P2.17 P2.19 P2.21 P2.23 P2.25 P2.27 P2.29 P2.31 P2.33 145.41,47.47 X1.2 | C14.1 75.56,11.91 v75.56,23.34 | IC9.7 95.88,5.56 97.15,6.83 IC17.10 97.15,20.8 95.88,22.07 95.88,32.23 97.15,33.5 IC7.10 | 125.09,47.47 121.28,43.66 JP6.1 | X1.PE@ X1.PE | C19.1 111.12,25.88 111.12,47.47 IC11.7 | C18.2 128.9,8.1 128.9,16.99 127.63,18.26 122.55,18.26 C20.1 | v97.15,93.19 97.15,95.73 98.42,97 C5.2
  Bottom 0.254: 81.91,79.22 IC16.15 | 23.49,3.02 IC3.8
  Bottom 0.406: P1.A28 6.98,77.95 IC15.7 | JP3.2 C10.1 | P1.A32 P1.C32 13.33,89.38 | 13.33,89.38 33.65,89.38 C9.2 36.19,89.38 55.24,89.38 56.51,90.65 60.32,90.65 | 13.33,89.38 JP3.4 | C12.1 64.13,56.36 v73.02,56.36 88.26,56.36 89.53,55.09 IC1.14 | IC16.13 v75.56,74.14 | v59.05,71.6 61.59,69.06 IC16.10 | v84.45,77.95 81.91,79.22 | 85.72,90.65 99.69,90.65 C6.2 99.69,93.19 v97.15,93.19 | 85.72,90.65 C8.2 | v100.96,83.03 IC1.26 | C11.1 60.32,93.19 60.32,90.65 | 85.72,90.65 73.02,90.65 | 73.02,90.65 60.32,90.65 | 73.02,90.65 IC16.2 | C21.1 67.94,37.31 62.86,37.31 IC5.8 | 8.25,10.64 P1.C1 C1.- | 8.25,10.64 P1.A1 | 24.76,1.75 23.49,3.02 | 24.76,1.75 36.19,1.75 | 36.19,1.75 37.46,3.02 IC4.8 | 36.19,1.75 53.97,1.75 55.24,3.02 IC6.7 | 8.25,10.64 8.25,1.75 24.76,1.75 | v12.06,32.23 20.95,32.23 JP1.1 | C2.2 122.55,67.79 121.28,66.52 118.74,66.52 C4.2 | C5.2 118.74,95.73 128.9,95.73 C3.2 132.71,94.46 P2.1 | IC12.7 113.66,76.68 114.93,75.41 122.55,75.41 123.82,76.68 IC13.7 126.36,76.68 128.9,74.14 P2.17 | P2.29 123.82,58.9 122.55,60.17 IC11.13 | C17.1 29.84,23.34 38.73,23.34 40,24.61 | 40,24.61 C16.1 45.08,25.88 53.97,25.88 55.24,24.61 v60.32,24.61 C7.2 74.29,24.61 v75.56,23.34 C19.1 109.85,24.61 | 40,24.61 JP8.3 | IC19.7 IC9.7 95.88,3.02 114.93,3.02 116.2,4.29 IC18.7 | X1.PE@ 147.95,41.12 X1.2 122.55,43.66 121.28,42.39 JP6.1 | C20.1 121.28,24.61 109.85,24.61 | IC10.7 125.09,47.47 123.82,46.2 114.93,46.2 113.66,47.47 IC11.7 | 109.85,24.61 102.23,24.61 102.23,28.42 100.96,29.69 100.96,30.96 98.42,33.5 97.15,33.5 IC7.10
HIGHDENS  (via drill 0.61, 0.7)
  Top 0.254: IC17.15 v86.99,30.96 | v107.31,38.58 107.31,29.69 106.04,28.42 103.5,28.42 100.96,30.96 v98.42,30.96
  Bottom 0.254: v86.99,30.96 88.26,32.23 | 88.26,32.23 89.53,33.5 IC7.7 | JP6.3 114.93,41.12 112.39,38.58 v107.31,38.58 | v98.42,30.96 89.53,30.96 88.26,32.23
MTRA  (via drill 0.61)
  Top 0.254: v122.55,74.14 122.55,83.03 127.63,83.03 127.63,84.3 IC13.11 | v83.18,72.87 v83.18,69.06 | v47.62,72.87 46.35,74.14 v46.35,75.41
  Bottom 0.254: v122.55,74.14 98.42,74.14 93.34,69.06 v83.18,69.06 | v47.62,72.87 v83.18,72.87 | v46.35,75.41 45.08,76.68 IC2.4
MTRB  (via drill 0.61)
  Top 0.254: v140.33,76.68 140.33,46.2 137.79,43.66 v137.79,37.31 | v99.69,28.42 v106.04,22.07
  Bottom 0.254: IC7.3 79.37,33.5 76.83,30.96 IC17.19 76.83,25.88 78.1,24.61 89.53,24.61 90.8,25.88 90.8,28.42 92.07,29.69 98.42,29.69 v99.69,28.42 | v140.33,76.68 135.25,76.68 135.25,80.49 130.17,80.49 128.9,81.76 IC13.5 | v137.79,37.31 139.06,36.04 145.41,36.04 150.49,30.96 150.49,24.61 128.9,24.61 126.36,22.07 v106.04,22.07
N$1  (via drill 0.61)
  Top 0.254: v14.6,19.53 14.6,6.83 JP9.6
  Bottom 0.254: v14.6,19.53 24.76,19.53 26.03,18.26 IC3.15
N$2
  Bottom 0.254: JP9.2 12.06,6.83 24.76,6.83 26.03,5.56 IC3.10
N$3
  Top 0.254: JP9.1 JP9.3 JP9.5 | JP9.7 18.41,1.75 32.38,1.75 33.65,3.02 33.65,9.37 37.46,13.18 IC4.4
  Bottom 0.254: JP9.5 JP9.7
N$4  (via drill 0.61)
  Top 0.254: v67.94,3.02 66.67,4.29 66.67,28.42 62.86,32.23 v62.86,43.66
  Bottom 0.254: v67.94,3.02 80.64,3.02 IC9.1 | v62.86,43.66 IC5.4
N$5  (via drill 0.61)
  Top 0.254: v27.3,15.72 27.3,11.91 28.57,10.64 IC3.12 | JP9.4 v13.33,16.99
  Bottom 0.254: v27.3,15.72 26.03,16.99 v13.33,16.99
N$6  (via drill 0.61)
  Top 0.254: v53.97,53.82 56.51,51.28 IC5.1 | v12.06,72.87 v12.06,88.11 | v14.6,71.6 17.14,69.06 v17.14,60.17
  Bottom 0.254: v53.97,53.82 52.7,55.09 31.11,55.09 29.84,56.36 IC8.19 23.49,56.36 23.49,58.9 22.22,60.17 v17.14,60.17 | v12.06,72.87 13.33,71.6 v14.6,71.6 | v12.06,88.11 IC15.3
N$7  (via drill 0.61)
  Top 0.254: v80.64,29.69 80.64,16.99 83.18,16.99 84.45,18.26 IC17.5
  Bottom 0.254: v80.64,29.69 84.45,33.5 IC7.5
N$8
  Top 0.254: IC5.5 59.05,41.12 62.86,44.93 62.86,47.47 64.13,48.74 IC5.15
N$10  (via drill 0.61)
  Top 0.254: v90.8,97 IC1.1 | v156.84,55.09 155.57,53.82 155.57,25.88 151.76,22.07 151.76,3.02 150.49,1.75 93.34,1.75 IC9.6
  Bottom 0.254: v90.8,97 92.07,98.27 153.03,98.27 156.84,94.46 v156.84,55.09
N$11  (via drill 0.61)
  Top 0.254: v17.14,39.85 17.14,47.47 18.41,48.74 IC8.5 | JP1.2 v23.49,39.85
  Bottom 0.254: v23.49,39.85 v17.14,39.85
N$12  (via drill 0.61)
  Top 0.254: v69.21,18.26 69.21,1.75 89.53,1.75 89.53,6.83 92.07,6.83 95.88,10.64 IC9.8
  Bottom 0.254: v69.21,18.26 67.94,19.53 61.59,19.53 60.32,18.26 IC6.1
N$13
  Bottom 0.254: RN3.4 120.01,34.77 123.82,38.58 JP4.2 126.36,38.58 127.63,39.85 141.6,39.85 X1.6
N$14  (via drill 0.61)
  Top 0.254: v22.22,43.66 22.22,46.2 23.49,47.47 23.49,57.63 22.22,58.9 22.22,65.25 15.87,71.6 15.87,84.3 17.14,85.57 IC15.4 | v24.76,22.07 v24.76,42.39 | v60.32,19.53 v60.32,10.64 | v85.72,9.37 90.8,9.37 IC9.10
  Bottom 0.254: v24.76,42.39 v22.22,43.66 | v24.76,22.07 27.3,19.53 v60.32,19.53 | v60.32,10.64 61.59,9.37 v85.72,9.37
N$15  (via drill 0.61)
  Top 0.254: v113.66,36.04 113.66,6.83 111.12,4.29 IC19.8
  Bottom 0.254: v113.66,36.04 116.2,38.58 122.55,38.58 122.55,41.12 JP4.1
N$16  (via drill 0.61)
  Top 0.254: v142.87,61.44 144.14,60.17 R9.1
  Bottom 0.254: v142.87,61.44 128.9,61.44 127.63,60.17 IC10.2
N$17  (via drill 0.61)
  Top 0.254: v123.82,65.25 123.82,56.36 125.09,55.09 IC10.4 | v137.79,65.25 RN1.8
  Bottom 0.254: v123.82,65.25 v137.79,65.25
N$18  (via drill 0.61)
  Top 0.254: IC12.4 113.66,84.3 114.93,85.57 114.93,88.11 113.66,89.38 IC12.2 IC12.1 | v109.85,69.06 116.2,62.71 116.2,44.93 118.74,42.39 JP6.2 | v102.23,69.06 v102.23,84.3
  Bottom 0.254: v109.85,69.06 v102.23,69.06 | v102.23,84.3 IC12.4
N$19
  Top 0.254: IC10.8 135.25,47.47 136.52,48.74 136.52,65.25 135.25,66.52 135.25,74.14 136.52,75.41 RN1.5
N$20  (via drill 0.61)
  Top 0.254: v128.9,72.87 128.9,70.33 130.17,69.06 130.17,52.55 127.63,50.01 IC10.6
  Bottom 0.254: v128.9,72.87 RN1.6
N$21  (via drill 0.61)
  Top 0.254: v56.51,30.96 59.05,28.42 JP5.2 | v53.97,37.31 R3.2
  Bottom 0.254: R3.2 v56.51,30.96 | IC2.19 43.81,38.58 45.08,37.31 v53.97,37.31
N$22  (via drill 0.7)
  Top 0.254: v114.93,55.09 114.93,50.01 113.66,48.74 111.12,48.74 v109.85,47.47 | v99.69,47.47 99.69,51.28 98.42,52.55 v98.42,55.09 | v83.18,50.01 83.18,41.12 81.91,39.85 IC7.4
  Bottom 0.254: IC7.4 81.91,36.04 83.18,37.31 85.72,37.31 85.72,28.42 84.45,28.42 IC17.16 | IC10.11 132.71,55.09 131.44,56.36 118.74,56.36 117.47,55.09 v114.93,55.09 | v109.85,47.47 108.58,46.2 100.96,46.2 v99.69,47.47 | v98.42,55.09 94.61,53.82 90.8,50.01 v83.18,50.01
N$23  (via drill 0.61)
  Top 0.254: v85.72,86.84 85.72,93.19 81.91,97 69.21,97 67.94,95.73 67.94,85.57 66.67,84.3 IC14.12 | v127.63,86.84 128.9,88.11 v128.9,94.46
  Bottom 0.254: v85.72,86.84 108.58,86.84 109.85,85.57 127.63,85.57 v127.63,86.84 | v128.9,94.46 131.44,94.46 132.71,93.19 147.95,93.19 150.49,90.65 155.57,90.65 155.57,85.57 149.22,85.57 147.95,84.3 142.87,84.3 141.6,83.03 141.6,77.95 RN1.4
N$24  (via drill 0.61)
  Top 0.254: IC17.6 86.99,20.8 85.72,22.07 85.72,32.23 86.99,33.5 IC7.6 | IC18.4 118.74,11.91 120.01,13.18 120.01,15.72 118.74,16.99 IC18.2 IC18.1 116.2,19.53 v116.2,27.15
  Bottom 0.254: IC7.6 86.99,36.04 88.26,37.31 97.15,37.31 98.42,36.04 98.42,34.77 102.23,30.96 102.23,29.69 103.5,28.42 106.04,28.42 107.31,27.15 v116.2,27.15
N$25
  Top 0.254: P2.32 156.84,58.9 156.84,97 150.49,97 146.68,93.19 146.68,85.57 RN1.16
N$28  (via drill 0.61)
  Top 0.254: v130.17,81.76 128.9,80.49 128.9,76.68 122.55,70.33 122.55,51.28 121.28,50.01 IC11.9
  Bottom 0.254: v130.17,81.76 128.9,83.03 122.55,83.03 121.28,81.76 IC12.10
N$29  (via drill 0.61)
  Top 0.254: v109.85,88.11 109.85,80.49 111.12,79.22 IC12.6
  Bottom 0.254: v109.85,88.11 114.93,88.11 116.2,86.84 IC12.12
N$30  (via drill 0.61)
  Top 0.254: v116.2,76.68 v116.2,88.11
  Bottom 0.254: v116.2,88.11 117.47,89.38 IC12.13 | v116.2,76.68 IC12.8
N$31  (via drill 0.61)
  Top 0.254: v109.85,77.95 108.58,79.22 v108.58,88.11
  Bottom 0.254: v109.85,77.95 117.47,77.95 118.74,79.22 IC12.9 | v108.58,88.11 109.85,86.84 IC12.3
N$32
  Top 0.254: IC13.8 133.98,76.68 135.25,77.95 135.25,81.76 140.33,81.76 140.33,84.3 139.06,85.57 RN1.1
N$35  (via drill 0.61)
  Top 0.254: IC18.6 118.74,6.83 122.55,3.02 150.49,3.02 150.49,13.18 R4.2 R5.2 | v141.6,42.39 141.6,89.38 IC13.13
  Bottom 0.254: v141.6,42.39 150.49,33.5 154.3,33.5 156.84,30.96 156.84,18.26 R5.2
N$36  (via drill 0.61)
  Top 0.254: 99.69,10.64 100.96,9.37 IC19.5 | 99.69,10.64 99.69,13.18 | 99.69,13.18 100.96,14.45 IC19.3 | 99.69,13.18 99.69,18.26 100.96,19.53 IC19.1 | v120.01,3.02 99.69,3.02 99.69,10.64 | v149.22,86.84 149.22,52.55 142.87,46.2 142.87,41.12 145.41,38.58 145.41,36.04 142.87,33.5 142.87,19.53 147.95,14.45 147.95,11.91 R6.2
  Bottom 0.254: R6.2 149.22,3.02 v120.01,3.02 | v149.22,86.84 IC13.12
N$37
  Top 0.254: R8.1 R7.1 | 104.77,10.64 104.77,8.1 103.5,6.83 IC19.6 | 104.77,10.64 103.5,11.91 IC19.4 | 104.77,10.64 104.77,15.72 103.5,16.99 IC19.2
  Bottom 0.254: R8.1 127.63,15.72 104.77,15.72 103.5,16.99 IC19.2
N$38
  Bottom 0.254: R7.2 137.79,6.83 140.33,6.83 JP7.4
N$39  (via drill 0.61)
  Top 0.254: v116.2,63.98 114.93,65.25 v114.93,81.76
  Bottom 0.254: v116.2,63.98 108.58,63.98 107.31,62.71 IC1.18 | v114.93,81.76 117.47,84.3 IC12.11
N$40
  Bottom 0.254: R8.2 132.71,10.64 136.52,10.64 139.06,8.1 146.68,8.1 147.95,6.83 JP7.1
N$41
  Top 0.254: R5.1 R4.1 136.52,11.91 C18.1
  Bottom 0.254: C18.1 133.98,8.1 120.01,8.1 118.74,9.37 IC18.5
N$43
  Bottom 0.254: P2.10 153.03,83.03 RN1.15
N$44  (via drill 0.61)
  Top 0.254: R1.1 137.79,47.47 v137.79,62.71 | v93.34,74.14 v93.34,66.52 | v75.56,83.03 v75.56,75.41 | v61.59,83.03 59.05,83.03 59.05,81.76 IC14.4
  Bottom 0.254: v137.79,62.71 140.33,65.25 140.33,69.06 111.12,69.06 108.58,66.52 v93.34,66.52 | v93.34,74.14 84.45,74.14 83.18,75.41 v75.56,75.41 | v61.59,83.03 v75.56,83.03
N$45  (via drill 0.61)
  Top 0.254: R1.2 140.33,37.31 v140.33,23.34
  Bottom 0.254: v140.33,23.34 LED1.K
N$46  (via drill 0.61)
  Top 0.254: v144.14,16.99 141.6,19.53 141.6,37.31 140.33,38.58 140.33,41.12 R2.2
  Bottom 0.254: LED2.K 154.3,16.99 v144.14,16.99
N$47  (via drill 0.61)
  Top 0.254: v132.71,41.12 131.44,39.85 v131.44,38.58 | v99.69,36.04 99.69,43.66 103.5,47.47 104.77,47.47 104.77,52.55 103.5,53.82 v103.5,77.95 | v70.48,85.57 69.21,86.84 v69.21,91.92 | v61.59,91.92 60.32,90.65 60.32,88.11 59.05,86.84 IC14.2
  Bottom 0.254: R2.1 130.17,41.12 v132.71,41.12 | v131.44,38.58 126.36,33.5 102.23,33.5 v99.69,36.04 | v103.5,77.95 98.42,77.95 93.34,83.03 93.34,84.3 84.45,84.3 83.18,85.57 v70.48,85.57 | v69.21,91.92 v61.59,91.92
N$48
  Bottom 0.254: P2.12 153.03,80.49 RN1.14
N$49  (via drill 0.61)
  Top 0.254: v23.49,60.17 23.49,65.25 20.95,67.79 20.95,89.38 19.68,90.65 IC15.2 | v47.62,57.63 48.89,56.36 48.89,44.93 IC2.24
  Bottom 0.254: v23.49,60.17 24.76,58.9 24.76,57.63 v47.62,57.63
N$50
  Bottom 0.254: P2.14 153.03,77.95 RN1.13
N$51  (via drill 0.61)
  Top 0.254: v9.52,4.29 6.98,6.83 v6.98,95.73 | v52.7,93.19 v52.7,83.03
  Bottom 0.254: v9.52,4.29 53.97,4.29 55.24,5.56 IC6.6 | v6.98,95.73 9.52,98.27 34.92,98.27 40,93.19 v52.7,93.19 | v52.7,83.03 56.51,79.22 IC14.5
N$52  (via drill 0.61)
  Top 0.254: v153.03,75.41 153.03,70.33 P2.22
  Bottom 0.254: RN1.12 v153.03,75.41
N$53
  Bottom 0.254: P2.24 153.03,67.79 150.49,67.79 149.22,66.52 141.6,66.52 141.6,71.6 142.87,72.87 RN1.11
N$54
  Bottom 0.254: P2.16 155.57,76.68 155.57,70.33 RN1.10
N$55
  Bottom 0.254: P2.18 153.03,72.87 150.49,72.87 149.22,71.6 142.87,71.6 142.87,69.06 144.14,67.79 RN1.9
N$56  (via drill 0.61)
  Top 0.254: v155.57,65.25 155.57,70.33 P2.20
  Bottom 0.254: R9.2 145.41,65.25 v155.57,65.25
N$57
  Top 0.254: IC4.1 37.46,20.8 JP8.2
N$58  (via drill 0.61)
  Top 0.254: v78.1,46.2 v78.1,71.6 78.1,93.19 v79.37,94.46 | v122.55,94.46 122.55,88.11 123.82,86.84 IC13.3
  Bottom 0.254: v78.1,46.2 99.69,46.2 103.5,42.39 RN3.7 | v78.1,71.6 IC16.9 | v79.37,94.46 v122.55,94.46
N$59  (via drill 0.61)
  Top 0.254: 106.04,44.93 108.58,42.39 108.58,25.88 107.31,24.61 107.31,13.18 108.58,11.91 IC19.11 | v88.26,76.68 v88.26,88.11 | v108.58,76.68 108.58,52.55 107.31,51.28 107.31,46.2 106.04,44.93 | 106.04,44.93 RN3.8
  Bottom 0.254: v88.26,88.11 75.56,88.11 74.29,86.84 IC16.3 | v108.58,76.68 v88.26,76.68
PHI2  (via drill 0.61)
  Top 0.254: v78.1,5.56 78.1,6.83 86.99,6.83 88.26,5.56 IC9.4 | v61.59,4.29 61.59,19.53 62.86,20.8 62.86,24.61 61.59,25.88 JP5.3 v61.59,39.85 | v4.44,72.87 4.44,8.1 9.52,3.02 9.52,1.75 17.14,1.75 17.14,4.29 32.38,4.29 v32.38,5.56
  Bottom 0.254: 61.59,42.39 53.97,42.39 IC2.25 | 61.59,42.39 62.86,42.39 64.13,43.66 IC5.13 | v78.1,5.56 76.83,4.29 v61.59,4.29 59.05,6.83 33.65,6.83 v32.38,5.56 | P1.C26 9.52,72.87 v4.44,72.87 | v61.59,39.85 61.59,42.39
PWRLED  (via drill 0.61)
  Top 0.254: v43.81,88.11 40,84.3 v40,71.6
  Bottom 0.254: v43.81,88.11 55.24,88.11 56.51,89.38 IC14.1 | v40,71.6 37.46,69.06 IC2.7
R/-W  (via drill 0.61)
  Top 0.254: v53.97,38.58 v53.97,44.93 | v93.34,75.41 93.34,84.3 92.07,85.57 IC1.2 | v75.56,67.79 74.29,66.52 v74.29,50.01 | v8.25,39.85 9.52,38.58 v9.52,9.37 | v41.27,9.37 43.81,11.91 43.81,22.07 45.08,23.34 v45.08,38.58
  Bottom 0.254: v53.97,44.93 62.86,44.93 64.13,46.2 IC5.14 70.48,46.2 v74.29,50.01 | v53.97,38.58 IC2.22 v45.08,38.58 | v93.34,75.41 94.61,74.14 94.61,71.6 84.45,71.6 83.18,70.33 78.1,70.33 v75.56,67.79 | P1.C25 6.98,67.79 6.98,65.25 4.44,65.25 1.9,62.71 1.9,39.85 v8.25,39.85 | v9.52,9.37 v41.27,9.37
SIDE0  (via drill 0.61)
  Top 0.254: v98.42,79.22 98.42,89.38 v92.07,95.73 | v38.73,95.73 36.19,93.19 36.19,83.03 IC2.2
  Bottom 0.254: v98.42,79.22 108.58,79.22 109.85,80.49 127.63,80.49 128.9,79.22 IC13.9 | v92.07,95.73 85.72,95.73 83.18,98.27 41.27,98.27 v38.73,95.73
SLOWCLK  (via drill 0.61)
  Top 0.254: v23.49,71.6 23.49,84.3 24.76,85.57 IC15.11 | v15.87,69.06 14.6,67.79 14.6,20.8 17.14,18.26 v17.14,15.72 | v41.27,14.45 42.54,15.72 v42.54,30.96 | v102.23,41.12 102.23,30.96 103.5,29.69 RN3.2
  Bottom 0.254: IC15.11 60.32,85.57 60.32,79.22 IC14.10 | X1.4 145.41,32.23 144.14,30.96 107.31,30.96 106.04,29.69 RN3.2 | v23.49,71.6 20.95,69.06 v15.87,69.06 | v17.14,15.72 18.41,14.45 v41.27,14.45 | v42.54,30.96 45.08,33.5 51.43,33.5 55.24,37.31 60.32,37.31 62.86,39.85 67.94,39.85 69.21,41.12 69.21,44.93 98.42,44.93 v102.23,41.12
STEP
  Bottom 0.254: IC1.16 104.77,57.63 103.5,58.9 103.5,61.44 123.82,61.44 125.09,62.71 IC10.1
UNI1  (via drill 0.61)
  Top 0.254: JP3.1 12.06,95.73 12.06,89.38 13.33,88.11 v13.33,75.41
  Bottom 0.254: v13.33,75.41 14.6,74.14 IC2.5
UNIT0  (via drill 0.61)
  Top 0.254: v27.3,95.73 28.57,94.46 v28.57,71.6
  Bottom 0.254: JP3.3 12.06,95.73 v27.3,95.73 | v28.57,71.6 IC2.6
VCC  (via drill 0.61)
  Top 0.254: IC3.16 31.11,20.8
  Top 0.406: C9.1 v37.46,93.19 43.81,93.19 v43.81,94.46 | IC15.14 C10.2 | IC11.14 C4.1 117.47,70.33 117.47,95.73 | IC10.14 C2.1 | IC13.14 C3.1 | 120.01,95.73 C5.1 | 120.01,95.73 IC12.14 | C11.2 IC14.14 | C8.1 IC16.20 | 117.47,95.73 98.42,95.73 C6.1 | 117.47,95.73 120.01,95.73 | P1.C2 P1.C3 | C1.+ 18.41,10.64 JP9.8 20.95,8.1 IC3.6 26.03,8.1 26.03,18.26 28.57,20.8 IC3.16 | C15.2 IC6.14 | IC4.16 C16.2 R3.1 | C13.2 IC8.20 28.57,58.9 29.84,57.63 29.84,52.55 | IC8.3 IC8.2 | 28.57,48.74 29.84,50.01 29.84,52.55 | 29.84,52.55 28.57,53.82 IC8.18 | 31.11,20.8 C17.2 31.11,30.96 | 31.11,30.96 JP1.3 | 31.11,32.23 IC2.20 | 31.11,30.96 31.11,32.23 | 28.57,48.74 31.11,46.2 31.11,32.23 | 28.57,48.74 IC8.16 | C19.2 111.12,19.53 IC19.14 | IC18.14 C20.2 139.06,23.34 139.06,20.8 140.33,19.53 140.33,9.37 | LED2.A 154.3,14.45 154.3,19.53 LED1.A | 140.33,9.37 142.87,6.83 JP7.3 JP7.2 | R6.1 140.33,9.37 | C14.2 80.64,13.18 IC9.14 80.64,10.64 75.56,5.56 73.02,5.56 v73.02,22.07 73.02,24.61 74.29,25.88 IC17.20 IC7.1 IC7.20 74.29,47.47 v75.56,48.74 | IC5.16 C12.2 | C21.2 v70.48,51.28 | v114.93,62.71 114.93,56.36 109.85,56.36 v109.85,55.09
  Bottom 0.254: 132.71,62.71 IC10.14 | IC16.20 79.37,91.92 | 131.44,91.92 IC13.14 | IC12.14 121.28,91.92 | 106.04,27.15 RN3.1 | RN2.1 93.34,51.28
  Bottom 0.406: v37.46,93.19 IC15.14 | 132.71,62.71 131.44,63.98 122.55,63.98 121.28,62.71 IC11.14 v114.93,62.71 | C6.1 C8.1 | 79.37,91.92 78.1,93.19 C11.2 64.13,94.46 v43.81,94.46 | 131.44,91.92 130.17,93.19 122.55,93.19 121.28,91.92 | C1.+ P1.C2 | IC4.6 33.65,8.1 32.38,6.83 26.03,6.83 24.76,8.1 IC3.6 | IC8.18 IC8.3 | IC2.20 31.11,36.04 28.57,38.58 IC8.12 | IC3.16 31.11,20.8 32.38,22.07 43.81,22.07 45.08,20.8 IC4.16 62.86,20.8 C15.2 v73.02,22.07 | 106.04,27.15 107.31,25.88 122.55,25.88 C20.2 | IC19.14 111.12,19.53 112.39,20.8 122.55,20.8 123.82,19.53 IC18.14 | LED2.A 154.3,11.91 140.33,11.91 R6.1 137.79,11.91 128.9,11.91 127.63,10.64 98.42,10.64 97.15,9.37 94.61,9.37 94.61,14.45 81.91,14.45 80.64,13.18 IC9.14 | 93.34,51.28 94.61,52.55 98.42,52.55 100.96,55.09 IC1.15 v109.85,55.09 | IC17.20 C7.1 | IC7.20 C21.2 | v70.48,51.28 IC5.16 | v75.56,48.74 92.07,48.74 RN2.1
WD_DRQ  (via drill 0.61)
  Top 0.254: v100.96,24.61 106.04,19.53 v106.04,4.29 | v121.28,5.56 v121.28,27.15 | v109.85,28.42 109.85,44.93 108.58,46.2 108.58,51.28 v109.85,52.55 | v103.5,52.55 102.23,53.82 v102.23,58.9 | v97.15,63.98 v97.15,83.03
  Bottom 0.254: v100.96,24.61 100.96,28.42 99.69,29.69 99.69,30.96 98.42,32.23 93.34,32.23 92.07,33.5 IC7.8 | v106.04,4.29 107.31,5.56 v121.28,5.56 | v121.28,27.15 120.01,28.42 v109.85,28.42 | v109.85,52.55 v103.5,52.55 | v102.23,58.9 v97.15,63.98 | v97.15,83.03 99.69,85.57 IC1.27
WD_INTR  (via drill 0.61)
  Top 0.254: v95.88,47.47 95.88,37.31 94.61,36.04 IC7.9 | v71.75,36.04 v71.75,46.2 | v60.32,39.85 v60.32,33.5 | v42.54,41.12 42.54,53.82 45.08,56.36 45.08,95.73 47.62,98.27 88.26,98.27 v88.26,89.38
  Bottom 0.254: v71.75,36.04 70.48,34.77 61.59,34.77 v60.32,33.5 | v60.32,39.85 46.35,39.85 45.08,41.12 v42.54,41.12 | v88.26,89.38 103.5,89.38 104.77,88.11 IC1.28 | v95.88,47.47 76.83,47.47 75.56,46.2 v71.75,46.2
WDCSEL
  Bottom 0.254: IC9.3 85.72,5.56 86.99,6.83 89.53,6.83 90.8,5.56 IC9.5
WRDATA  (via drill 0.61)
  Top 0.254: v130.17,71.6 132.71,69.06 132.71,65.25 131.44,63.98 131.44,51.28 132.71,50.01 IC10.9
  Bottom 0.254: v130.17,71.6 108.58,71.6 107.31,72.87 IC1.22
WRGATE  (via drill 0.61)
  Top 0.254: v127.63,70.33 128.9,69.06 128.9,53.82 IC10.5
  Bottom 0.254: IC1.21 v127.63,70.33

## Text on the board
Top: CSA-DRVIO-V1.0B | (C) A. Fachat